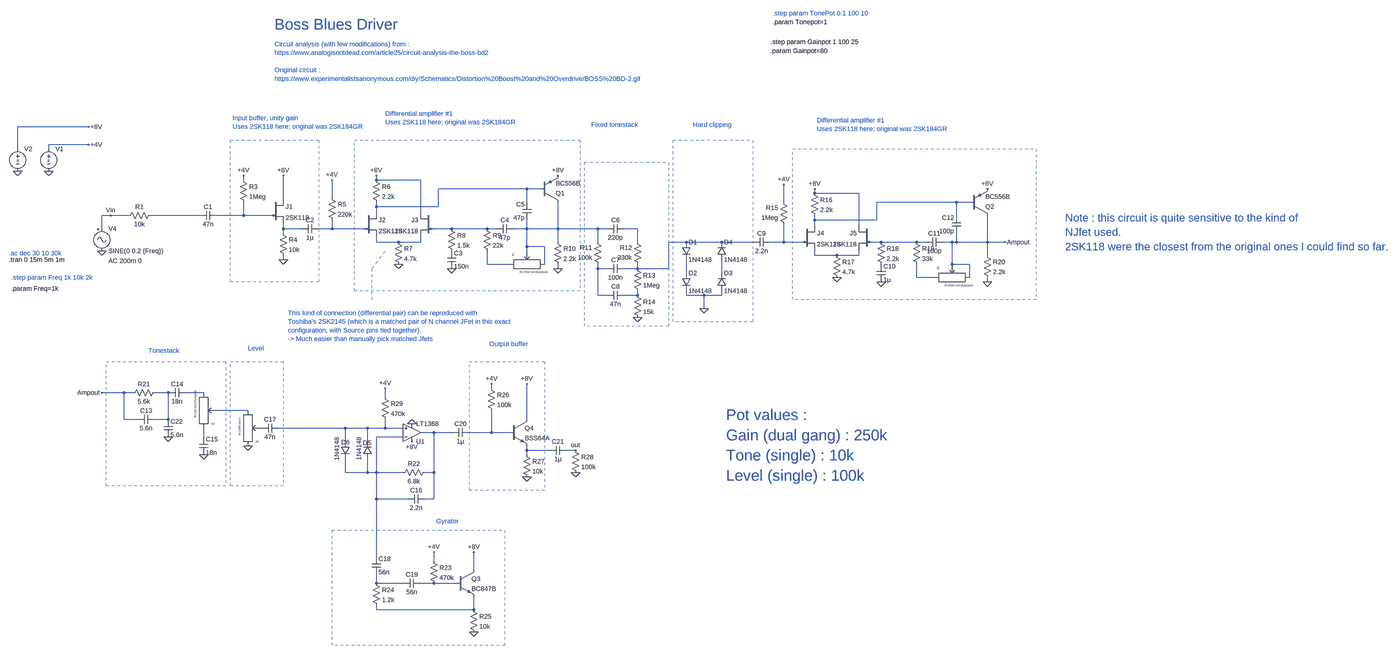
[diagram p0: schematic BossBluesDriver.asc, whole sheet]
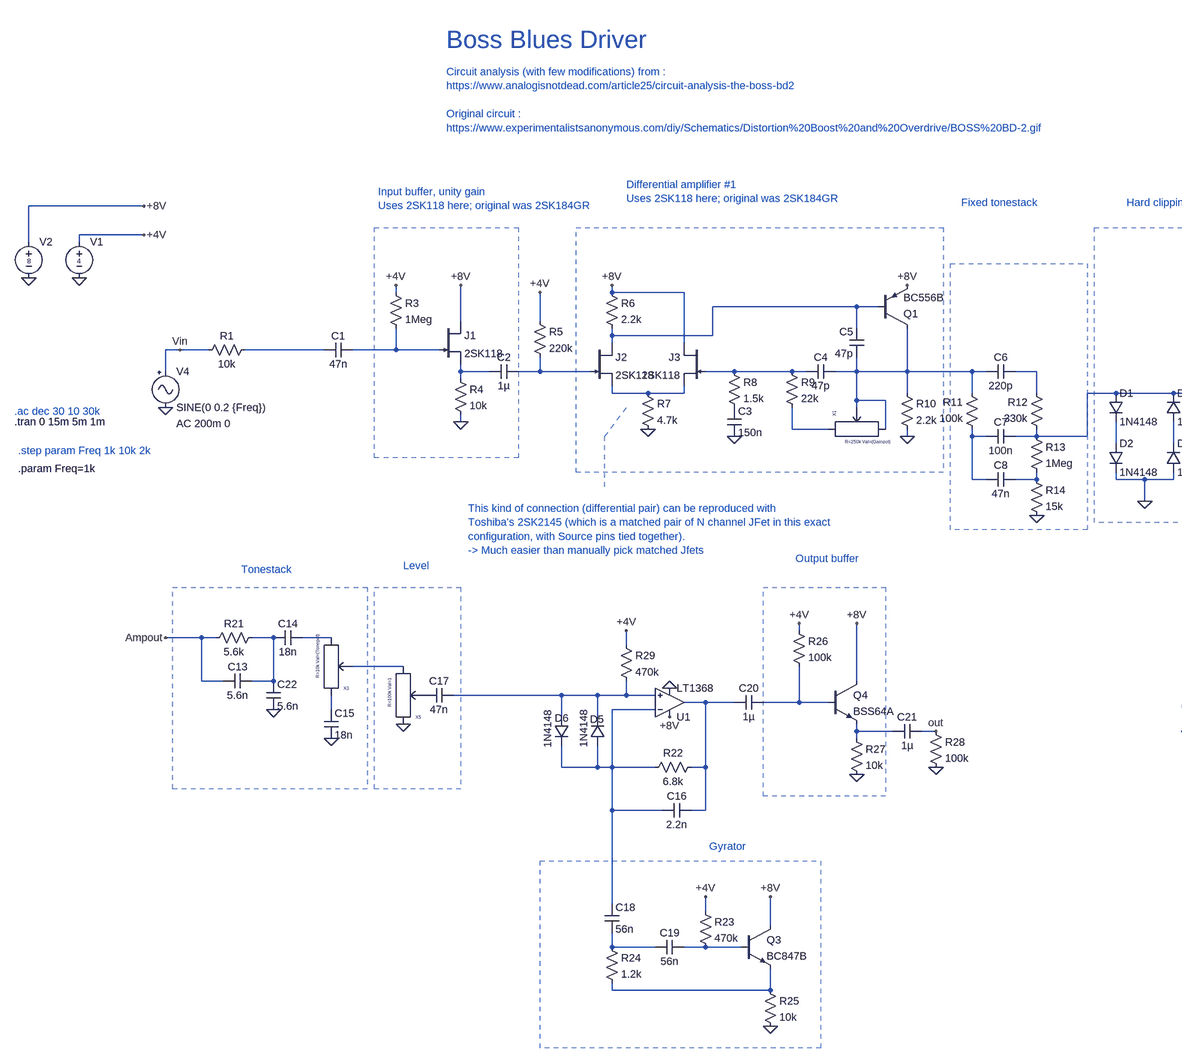
[diagram p1: schematic BossBluesDriver.asc, part, row 1 of 1, column 1 of 2]
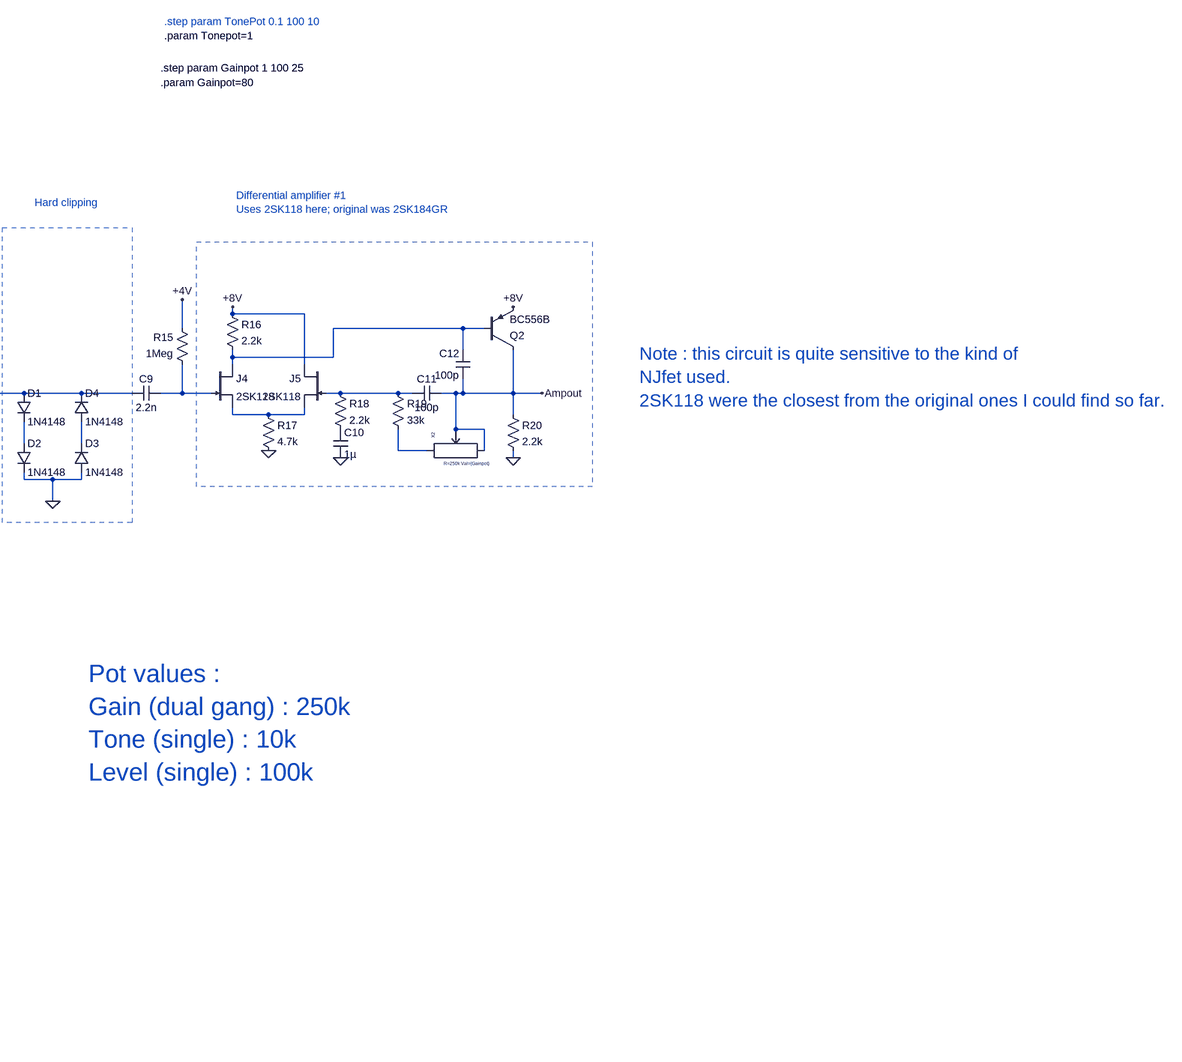
[diagram p2: schematic BossBluesDriver.asc, part, row 1 of 1, column 2 of 2]
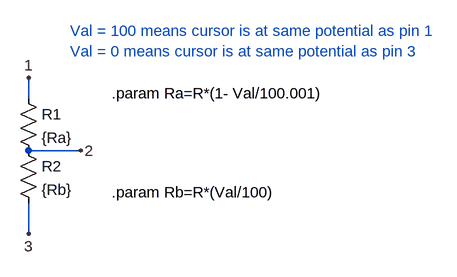
[diagram p3: sub-circuit potentiometer.asc]
BossBluesDriver.asc, the LTspice schematic file:
Version 4
SHEET 1 4768 1732
WIRE -304 -144 -560 -144
WIRE -304 -80 -448 -80
WIRE -560 -64 -560 -144
WIRE -448 -64 -448 -80
WIRE 256 48 256 32
WIRE 736 48 736 32
WIRE 896 48 736 48
WIRE 1280 80 960 80
WIRE 1328 80 1280 80
WIRE 2320 96 2320 80
WIRE 2480 96 2320 96
WIRE 400 112 400 32
WIRE 576 112 576 48
WIRE 1280 128 1280 80
WIRE 2208 128 2208 64
WIRE 2832 128 2544 128
WIRE 2880 128 2832 128
WIRE 736 144 736 128
WIRE 960 144 960 80
WIRE 960 144 736 144
WIRE 736 160 736 144
WIRE 896 160 896 48
WIRE -224 176 -256 176
WIRE -160 176 -224 176
WIRE 96 176 -80 176
WIRE 256 176 256 128
WIRE 256 176 160 176
WIRE 352 176 256 176
WIRE 2832 176 2832 128
WIRE 2320 192 2320 176
WIRE 2544 192 2544 128
WIRE 2544 192 2320 192
WIRE 2320 208 2320 192
WIRE 2480 208 2480 96
WIRE -256 224 -256 176
WIRE 400 224 400 208
WIRE 464 224 400 224
WIRE 576 224 576 192
WIRE 576 224 528 224
WIRE 688 224 576 224
WIRE 1008 224 944 224
WIRE 1136 224 1008 224
WIRE 1168 224 1136 224
WIRE 1280 224 1280 192
WIRE 1280 224 1232 224
WIRE 1392 224 1392 128
WIRE 1392 224 1280 224
WIRE 1536 224 1392 224
WIRE 1568 224 1536 224
WIRE 1680 224 1632 224
WIRE 400 240 400 224
WIRE 736 272 736 256
WIRE 816 272 736 272
WIRE 896 272 896 256
WIRE 896 272 816 272
WIRE 1392 272 1392 224
WIRE 1536 272 1536 224
WIRE 1680 272 1680 224
WIRE 1856 272 1792 272
WIRE 1984 272 1856 272
WIRE 2096 272 1984 272
WIRE 2208 272 2208 208
WIRE 2208 272 2160 272
WIRE 2272 272 2208 272
WIRE 2560 272 2528 272
WIRE 2688 272 2560 272
WIRE 2720 272 2688 272
WIRE 2816 272 2784 272
WIRE 2832 272 2832 240
WIRE 2832 272 2816 272
WIRE 2944 272 2944 176
WIRE 2944 272 2832 272
WIRE 3008 272 2944 272
WIRE 1280 288 1280 224
WIRE 1344 288 1280 288
WIRE 1280 304 1280 288
WIRE 2320 320 2320 304
WIRE 2400 320 2320 320
WIRE 2480 320 2480 304
WIRE 2480 320 2400 320
WIRE 2944 320 2944 272
WIRE 400 336 400 320
WIRE 1136 352 1136 304
WIRE 1216 352 1136 352
WIRE 1344 352 1344 288
WIRE 2816 352 2816 272
WIRE 2880 352 2816 352
WIRE 1392 368 1392 352
WIRE 1536 368 1536 352
WIRE 1568 368 1536 368
WIRE 1680 368 1680 352
WIRE 1680 368 1632 368
WIRE 1792 368 1792 272
WIRE 1792 368 1680 368
WIRE 1856 384 1856 336
WIRE 1984 384 1984 336
WIRE 2688 400 2688 352
WIRE 2752 400 2688 400
WIRE 2880 400 2880 352
WIRE 2944 416 2944 400
WIRE 1536 464 1536 368
WIRE 1568 464 1536 464
WIRE 1680 464 1680 448
WIRE 1680 464 1632 464
WIRE 1856 464 1856 448
WIRE 1920 464 1856 464
WIRE 1984 464 1984 448
WIRE 1984 464 1920 464
WIRE 1920 512 1920 464
WIRE 1152 800 1152 784
WIRE -176 816 -256 816
WIRE -144 816 -176 816
WIRE -16 816 -64 816
WIRE 112 816 48 816
WIRE 768 832 768 800
WIRE 272 880 160 880
WIRE -176 912 -176 816
WIRE -128 912 -176 912
WIRE -16 912 -16 816
WIRE -16 912 -64 912
WIRE 1280 912 1280 784
WIRE 624 944 384 944
WIRE 704 944 624 944
WIRE 768 944 768 912
WIRE 768 944 704 944
WIRE 832 944 768 944
WIRE 944 960 896 960
WIRE 1008 960 944 960
WIRE 1152 960 1152 880
WIRE 1152 960 1072 960
WIRE 1216 960 1152 960
WIRE 112 976 112 944
WIRE 832 976 736 976
WIRE 624 992 624 944
WIRE 704 992 704 944
WIRE 1280 1024 1280 1008
WIRE 1360 1024 1280 1024
WIRE 1456 1024 1424 1024
WIRE 1280 1040 1280 1024
WIRE 624 1104 624 1056
WIRE 704 1104 704 1056
WIRE 704 1104 624 1104
WIRE 736 1104 736 976
WIRE 736 1104 704 1104
WIRE 832 1104 736 1104
WIRE 944 1104 944 960
WIRE 944 1104 912 1104
WIRE 736 1200 736 1104
WIRE 848 1200 736 1200
WIRE 944 1200 944 1104
WIRE 944 1200 912 1200
WIRE 736 1408 736 1200
WIRE 944 1424 944 1392
WIRE 1088 1456 1088 1392
WIRE 736 1504 736 1472
WIRE 832 1504 736 1504
WIRE 944 1504 896 1504
WIRE 1024 1504 944 1504
WIRE 736 1600 736 1584
WIRE 1088 1600 1088 1552
WIRE 1088 1600 736 1600
FLAG -560 16 0
FLAG -304 -80 +4V
FLAG -304 -144 +8V
FLAG -256 304 0
FLAG -224 176 Vin
FLAG -448 16 0
FLAG 256 32 +4V
FLAG 400 32 +8V
FLAG 400 336 0
FLAG 576 48 +4V
FLAG 736 32 +8V
FLAG 816 352 0
FLAG 1008 368 0
FLAG 1392 32 +8V
FLAG 1392 368 0
FLAG 1680 544 0
FLAG 1920 512 0
FLAG 2208 64 +4V
FLAG 2320 80 +8V
FLAG 2400 400 0
FLAG 2560 416 0
FLAG 2944 80 +8V
FLAG 2944 416 0
FLAG 3008 272 Ampout
FLAG -256 816 Ampout
FLAG 112 1040 0
FLAG 272 1008 0
FLAG 944 1392 +4V
FLAG 1088 1392 +8V
FLAG 1088 1680 0
FLAG 864 928 0
FLAG 864 992 +8V
FLAG 1280 1120 0
FLAG 1152 784 +4V
FLAG 1280 784 +8V
FLAG 1456 1104 0
FLAG 768 800 +4V
FLAG -16 976 0
FLAG 1456 1024 out
SYMBOL voltage -560 -80 R0
WINDOW 123 0 0 Left 0
WINDOW 39 0 0 Left 0
WINDOW 3 -4 58 Left 1
SYMATTR Value 8
SYMATTR InstName V2
SYMBOL Misc\\signal -256 208 R0
WINDOW 123 24 132 Left 2
WINDOW 39 0 0 Left 0
SYMATTR Value2 AC 200m 0
SYMATTR InstName V4
SYMATTR Value SINE(0 0.2 {Freq})
SYMBOL voltage -448 -80 R0
WINDOW 123 0 0 Left 0
WINDOW 39 0 0 Left 0
WINDOW 3 -5 58 Left 1
SYMATTR Value 4
SYMATTR InstName V1
SYMBOL cap 160 160 R90
WINDOW 0 0 32 VBottom 2
WINDOW 3 32 32 VTop 2
SYMATTR InstName C1
SYMATTR Value 47n
SYMBOL res 240 32 R0
SYMATTR InstName R3
SYMATTR Value 1Meg
SYMBOL res 384 224 R0
SYMATTR InstName R4
SYMATTR Value 10k
SYMBOL cap 528 208 R90
WINDOW 0 0 32 VBottom 2
WINDOW 3 32 32 VTop 2
SYMATTR InstName C2
SYMATTR Value 1µ
SYMBOL res 560 96 R0
SYMATTR InstName R5
SYMATTR Value 220k
SYMBOL njf 688 160 R0
SYMATTR InstName J2
SYMATTR Value 2SK118
SYMBOL res 720 32 R0
SYMATTR InstName R6
SYMATTR Value 2.2k
SYMBOL res 800 256 R0
SYMATTR InstName R7
SYMATTR Value 4.7k
SYMBOL njf 944 160 M0
SYMATTR InstName J3
SYMATTR Value 2SK118
SYMBOL res 992 208 R0
SYMATTR InstName R8
SYMATTR Value 1.5k
SYMBOL cap 992 304 R0
SYMATTR InstName C3
SYMATTR Value 150n
SYMBOL res 1120 208 R0
SYMATTR InstName R9
SYMATTR Value 22k
SYMBOL Potentiometer 1280 352 R270
WINDOW 39 -29 -26 VRight 0
SYMATTR SpiceLine R=250k Val={Gainpot}
SYMATTR InstName X1
SYMBOL cap 1232 208 R90
WINDOW 0 0 32 VBottom 2
WINDOW 3 32 32 VTop 2
SYMATTR InstName C4
SYMATTR Value 47p
SYMBOL cap 1296 192 R180
WINDOW 0 24 56 Left 2
WINDOW 3 24 8 Left 2
SYMATTR InstName C5
SYMATTR Value 47p
SYMBOL pnp 1328 128 M180
SYMATTR InstName Q1
SYMATTR Value BC556B
SYMBOL res 1376 256 R0
SYMATTR InstName R10
SYMATTR Value 2.2k
SYMBOL cap 1632 208 R90
WINDOW 0 0 32 VBottom 2
WINDOW 3 32 32 VTop 2
SYMATTR InstName C6
SYMATTR Value 220p
SYMBOL res 1552 368 R180
WINDOW 0 36 76 Left 2
WINDOW 3 36 40 Left 2
SYMATTR InstName R11
SYMATTR Value 100k
SYMBOL res 1696 368 R180
WINDOW 0 36 76 Left 2
WINDOW 3 36 40 Left 2
SYMATTR InstName R12
SYMATTR Value 330k
SYMBOL cap 1632 352 R90
WINDOW 0 0 32 VBottom 2
WINDOW 3 32 32 VTop 2
SYMATTR InstName C7
SYMATTR Value 100n
SYMBOL cap 1632 448 R90
WINDOW 0 0 32 VBottom 2
WINDOW 3 32 32 VTop 2
SYMATTR InstName C8
SYMATTR Value 47n
SYMBOL res 1664 352 R0
SYMATTR InstName R13
SYMATTR Value 1Meg
SYMBOL res 1664 448 R0
SYMATTR InstName R14
SYMATTR Value 15k
SYMBOL diode 1840 272 R0
SYMATTR InstName D1
SYMATTR Value 1N4148
SYMBOL diode 1840 384 R0
SYMATTR InstName D2
SYMATTR Value 1N4148
SYMBOL diode 1968 448 M180
WINDOW 0 24 64 Left 2
WINDOW 3 24 0 Left 2
SYMATTR InstName D3
SYMATTR Value 1N4148
SYMBOL diode 1968 336 M180
WINDOW 0 24 64 Left 2
WINDOW 3 24 0 Left 2
SYMATTR InstName D4
SYMATTR Value 1N4148
SYMBOL cap 2160 256 R90
WINDOW 0 0 32 VBottom 2
WINDOW 3 32 32 VTop 2
SYMATTR InstName C9
SYMATTR Value 2.2n
SYMBOL res 2224 224 R180
WINDOW 0 36 76 Left 2
WINDOW 3 36 40 Left 2
SYMATTR InstName R15
SYMATTR Value 1Meg
SYMBOL njf 2272 208 R0
SYMATTR InstName J4
SYMATTR Value 2SK118
SYMBOL res 2304 80 R0
SYMATTR InstName R16
SYMATTR Value 2.2k
SYMBOL res 2384 304 R0
SYMATTR InstName R17
SYMATTR Value 4.7k
SYMBOL njf 2528 208 M0
SYMATTR InstName J5
SYMATTR Value 2SK118
SYMBOL res 2544 256 R0
SYMATTR InstName R18
SYMATTR Value 2.2k
SYMBOL cap 2544 352 R0
SYMATTR InstName C10
SYMATTR Value 1µ
SYMBOL res 2672 256 R0
SYMATTR InstName R19
SYMATTR Value 33k
SYMBOL Potentiometer 2816 400 R270
WINDOW 39 -29 -26 VRight 0
SYMATTR SpiceLine R=250k Val={Gainpot}
SYMATTR InstName X2
SYMBOL cap 2784 256 R90
WINDOW 0 0 32 VBottom 2
WINDOW 3 32 32 VTop 2
SYMATTR InstName C11
SYMATTR Value 100p
SYMBOL cap 2848 240 R180
WINDOW 0 24 56 Left 2
WINDOW 3 24 8 Left 2
SYMATTR InstName C12
SYMATTR Value 100p
SYMBOL pnp 2880 176 M180
SYMATTR InstName Q2
SYMATTR Value BC556B
SYMBOL res 2928 304 R0
SYMATTR InstName R20
SYMATTR Value 2.2k
SYMBOL res -48 800 R90
WINDOW 0 0 56 VBottom 2
WINDOW 3 32 56 VTop 2
SYMATTR InstName R21
SYMATTR Value 5.6k
SYMBOL cap -64 896 R90
WINDOW 0 0 32 VBottom 2
WINDOW 3 32 32 VTop 2
SYMATTR InstName C13
SYMATTR Value 5.6n
SYMBOL cap 48 800 R90
WINDOW 0 0 32 VBottom 2
WINDOW 3 32 32 VTop 2
SYMATTR InstName C14
SYMATTR Value 18n
SYMBOL Potentiometer 112 880 M180
WINDOW 39 -29 -26 VRight 0
SYMATTR SpiceLine R=10k Val={Tonepot}
SYMATTR InstName X3
SYMBOL cap 96 976 R0
SYMATTR InstName C15
SYMATTR Value 18n
SYMBOL Potentiometer 272 944 M180
WINDOW 39 -29 -26 VRight 0
SYMATTR SpiceLine R=100k Val=1
SYMATTR InstName X5
SYMBOL cap 384 928 R90
WINDOW 0 0 32 VBottom 2
WINDOW 3 32 32 VTop 2
SYMATTR InstName C17
SYMATTR Value 47n
SYMBOL diode 720 1056 R180
WINDOW 0 2 59 Left 2
WINDOW 3 126 -5 VRight 2
SYMATTR InstName D5
SYMATTR Value 1N4148
SYMBOL diode 608 992 R0
WINDOW 0 1 3 Left 2
WINDOW 3 66 68 VLeft 2
SYMATTR InstName D6
SYMATTR Value 1N4148
SYMBOL res 928 1088 R90
WINDOW 0 0 56 VBottom 2
WINDOW 3 32 56 VTop 2
SYMATTR InstName R22
SYMATTR Value 6.8k
SYMBOL cap 912 1184 R90
WINDOW 0 0 32 VBottom 2
WINDOW 3 32 32 VTop 2
SYMATTR InstName C16
SYMATTR Value 2.2n
SYMBOL cap 720 1408 R0
SYMATTR InstName C18
SYMATTR Value 56n
SYMBOL cap 896 1488 R90
WINDOW 0 0 32 VBottom 2
WINDOW 3 32 32 VTop 2
SYMATTR InstName C19
SYMATTR Value 56n
SYMBOL res 928 1408 R0
SYMATTR InstName R23
SYMATTR Value 470k
SYMBOL npn 1024 1456 R0
SYMATTR InstName Q3
SYMATTR Value BC847B
SYMBOL res 720 1488 R0
SYMATTR InstName R24
SYMATTR Value 1.2k
SYMBOL res 1072 1584 R0
SYMATTR InstName R25
SYMATTR Value 10k
SYMBOL cap 1072 944 R90
WINDOW 0 0 32 VBottom 2
WINDOW 3 32 32 VTop 2
SYMATTR InstName C20
SYMATTR Value 1µ
SYMBOL res 1136 784 R0
SYMATTR InstName R26
SYMATTR Value 100k
SYMBOL npn 1216 912 R0
SYMATTR InstName Q4
SYMATTR Value BSS64A
SYMBOL res 1264 1024 R0
SYMATTR InstName R27
SYMATTR Value 10k
SYMBOL cap 1424 1008 R90
WINDOW 0 0 32 VBottom 2
WINDOW 3 32 32 VTop 2
SYMATTR InstName C21
SYMATTR Value 1µ
SYMBOL res 1440 1008 R0
SYMATTR InstName R28
SYMATTR Value 100k
SYMBOL res 752 816 R0
SYMATTR InstName R29
SYMATTR Value 470k
SYMBOL cap -32 912 R0
SYMATTR InstName C22
SYMATTR Value 5.6n
SYMBOL res -64 160 R90
WINDOW 0 0 56 VBottom 2
WINDOW 3 32 56 VTop 2
SYMATTR InstName R1
SYMATTR Value 10k
SYMBOL njf 352 112 R0
SYMATTR InstName J1
SYMATTR Value 2SK118
SYMBOL OpAmps\\LT1368 864 1024 M180
SYMATTR InstName U1
TEXT -592 336 Left 2 !.tran 0 15m 5m 1m
TEXT 2160 -544 Left 2 !.step param Gainpot 1 100 25
TEXT 2160 -512 Left 2 !.param Gainpot=80
TEXT -584 400 Left 2 ;.step param Freq 1k 10k 2k
TEXT -584 440 Left 2 !.param Freq=1k
TEXT 368 -608 Left 5 ;Boss Blues Driver
TEXT -592 312 Left 2 ;.ac dec 30 10 30k
TEXT 2168 -648 Left 2 ;.step param TonePot 0.1 100 10
TEXT 2168 -616 Left 2 !.param Tonepot=1
TEXT 368 -536 Left 2 ;Circuit analysis (with few modifications) from :\nhttps://www.analogisnotdead.com/article25/circuit-analysis-the-boss-bd2 \n \nOriginal circuit :\nhttps://www.experimentalistsanonymous.com/diy/Schematics/Distortion%20Boost%20and%20Overdrive/BOSS%20BD-2.gif
TEXT 768 -192 Left 2 ;Differential amplifier #1\nUses 2SK118 here; original was 2SK184GR
TEXT 216 -176 Left 2 ;Input buffer, unity gain\nUses 2SK118 here; original was 2SK184GR
TEXT 2328 -168 Left 2 ;Differential amplifier #1\nUses 2SK118 here; original was 2SK184GR
TEXT 1880 -152 Left 2 ;Hard clipping
TEXT 1512 -152 Left 2 ;Fixed tonestack
TEXT -88 664 Left 2 ;Tonestack
TEXT 272 656 Left 2 ;Level
TEXT 952 1280 Left 2 ;Gyrator
TEXT 1144 640 Left 2 ;Output buffer
TEXT 3328 184 Left 4 ;Note : this circuit is quite sensitive to the kind of \nNJfet used. \n2SK118 were the closest from the original ones I could find so far.
TEXT 2000 896 Left 5 ;Pot values : \nGain (dual gang) : 250k\nTone (single) : 10k\nLevel (single) : 100k
TEXT 416 528 Left 2 ;This kind of connection (differential pair) can be reproduced with \nToshiba's 2SK2145 (which is a matched pair of N channel JFet in this exact\nconfiguration, with Source pins tied together).\n-> Much easier than manually pick matched Jfets
LINE Normal 720 368 768 304 2
LINE Normal 720 480 720 368 2
LINE Normal 912 528 912 528 2
RECTANGLE Normal 528 416 208 -96 2
RECTANGLE Normal 1472 448 656 -96 2
RECTANGLE Normal 1792 576 1488 -16 2
RECTANGLE Normal 3120 480 2240 -64 2
RECTANGLE Normal 2096 560 1808 -96 2
RECTANGLE Normal 192 1152 -240 704 2
RECTANGLE Normal 400 1152 208 704 2
RECTANGLE Normal 1200 1728 576 1312 2
RECTANGLE Normal 1344 1168 1072 704 2

potentiometer.asc, the sub-circuit schematic file:
Version 4
SHEET 1 908 680
WIRE 192 96 192 64
WIRE 272 176 192 176
WIRE 192 304 192 256
FLAG 192 64 1
FLAG 272 176 2
FLAG 192 304 3
SYMBOL res 176 80 R0
SYMATTR InstName R1
SYMATTR Value {Ra}
SYMBOL res 176 160 R0
SYMATTR InstName R2
SYMATTR Value {Rb}
TEXT 320 88 Left 2 !.param Ra=R*(1- Val/100.001)
TEXT 320 240 Left 2 !.param Rb=R*(Val/100)
TEXT 256 -8 Left 2 ;Val = 100 means cursor is at same potential as pin 1\nVal = 0 means cursor is at same potential as pin 3

The netlist it stands for:
* BossBluesDriver.asc
V2 +8V 0 8
V4 Vin 0 SINE(0 0.2 {Freq}) AC 200m 0
V1 +4V 0 4
C1 N004 N003 47n
R3 +4V N004 1Meg
R4 N005 0 10k
C2 N006 N005 1µ
R5 +4V N006 220k
J2 N001 N006 N010 2SK118
R6 +8V N001 2.2k
R7 N010 0 4.7k
J3 +8V N007 N010 2SK118
R8 N007 P001 1.5k
C3 P001 0 150n
R9 N007 N015 22k
XX1 N015 N008 N008 potentiometer params: R=250k Val={Gainpot}
C4 N008 N007 47p
C5 N008 N001 47p
Q1 N008 N001 +8V 0 BC556B
R10 N008 0 2.2k
C6 N009 N008 220p
R11 N016 N008 100k
R12 N011 N009 330k
C7 N011 N016 100n
C8 N020 N016 47n
R13 N011 N020 1Meg
R14 N020 0 15k
D1 N011 N017 1N4148
D2 N017 0 1N4148
D3 0 N018 1N4148
D4 N018 N011 1N4148
C9 N012 N011 2.2n
R15 N012 +4V 1Meg
J4 N002 N012 N014 2SK118
R16 +8V N002 2.2k
R17 N014 0 4.7k
J5 +8V N013 N014 2SK118
R18 N013 P002 2.2k
C10 P002 0 1µ
R19 N013 N019 33k
XX2 N019 Ampout Ampout potentiometer params: R=250k Val={Gainpot}
C11 Ampout N013 100p
C12 Ampout N002 100p
Q2 Ampout N002 +8V 0 BC556B
R20 Ampout 0 2.2k
R21 N021 Ampout 5.6k
C13 N021 Ampout 5.6n
C14 N022 N021 18n
XX3 N027 N023 N022 potentiometer params: R=10k Val={Tonepot}
C15 N027 0 18n
XX5 0 P003 N023 potentiometer params: R=100k Val=1
C17 N024 P003 47n
D5 N028 N024 1N4148
D6 N024 N028 1N4148
R22 N025 N028 6.8k
C16 N025 N028 2.2n
C18 N028 N030 56n
C19 N031 N030 56n
R23 +4V N031 470k
Q3 +8V N031 N032 0 BC847B
R24 N030 N032 1.2k
R25 N032 0 10k
C20 N026 N025 1µ
R26 +4V N026 100k
Q4 +8V N026 N029 0 BSS64A
R27 N029 0 10k
C21 out N029 1µ
R28 out 0 100k
R29 +4V N024 470k
C22 N021 0 5.6n
R1 N003 Vin 10k
J1 +8V N004 N005 2SK118
XU1 N024 N028 +8V 0 N025 LT1368  ; pins In+ In- V+ V- OUT

* block symbol definitions
.subckt potentiometer 1 2 3
R1 1 2 {Ra}
R2 2 3 {Rb}
.param Ra=R*(1- Val/100.001)
.param Rb=R*(Val/100)
* Val = 100 means cursor is at same potential as pin 1
* Val = 0 means cursor is at same potential as pin 3
.ends potentiometer

.model D D
.lib standard.dio
.model NPN NPN
.model PNP PNP
.lib standard.bjt
.model NJF NJF
.model PJF PJF
.lib standard.jft
.tran 0 15m 5m 1m
.step param Gainpot 1 100 25
.param Gainpot=80
* .step param Freq 1k 10k 2k
.param Freq=1k
* Boss Blues Driver
* .ac dec 30 10 30k
* .step param TonePot 0.1 100 10
.param Tonepot=1
* Circuit analysis (with few modifications) from :
* https://www.analogisnotdead.com/article25/circuit-analysis-the-boss-bd2
* Original circuit :
* https://www.experimentalistsanonymous.com/diy/Schematics/Distortion%20Boost%20and%20Overdrive/BOSS%20BD-2.gif
* Differential amplifier #1
* Uses 2SK118 here; original was 2SK184GR
* Input buffer, unity gain
* Uses 2SK118 here; original was 2SK184GR
* Differential amplifier #1
* Uses 2SK118 here; original was 2SK184GR
* Hard clipping
* Fixed tonestack
* Tonestack
* Level
* Gyrator
* Output buffer
* Note : this circuit is quite sensitive to the kind of
* NJfet used.
* 2SK118 were the closest from the original ones I could find so far.
* Pot values :
* Gain (dual gang) : 250k
* Tone (single) : 10k
* Level (single) : 100k
* This kind of connection (differential pair) can be reproduced with
* Toshiba's 2SK2145 (which is a matched pair of N channel JFet in this exact
* configuration, with Source pins tied together).
* -> Much easier than manually pick matched Jfets
.backanno
.end